# Altium schematic sheet power.SchDoc
size A4; SheetNumber: 1; SheetTotal: 3
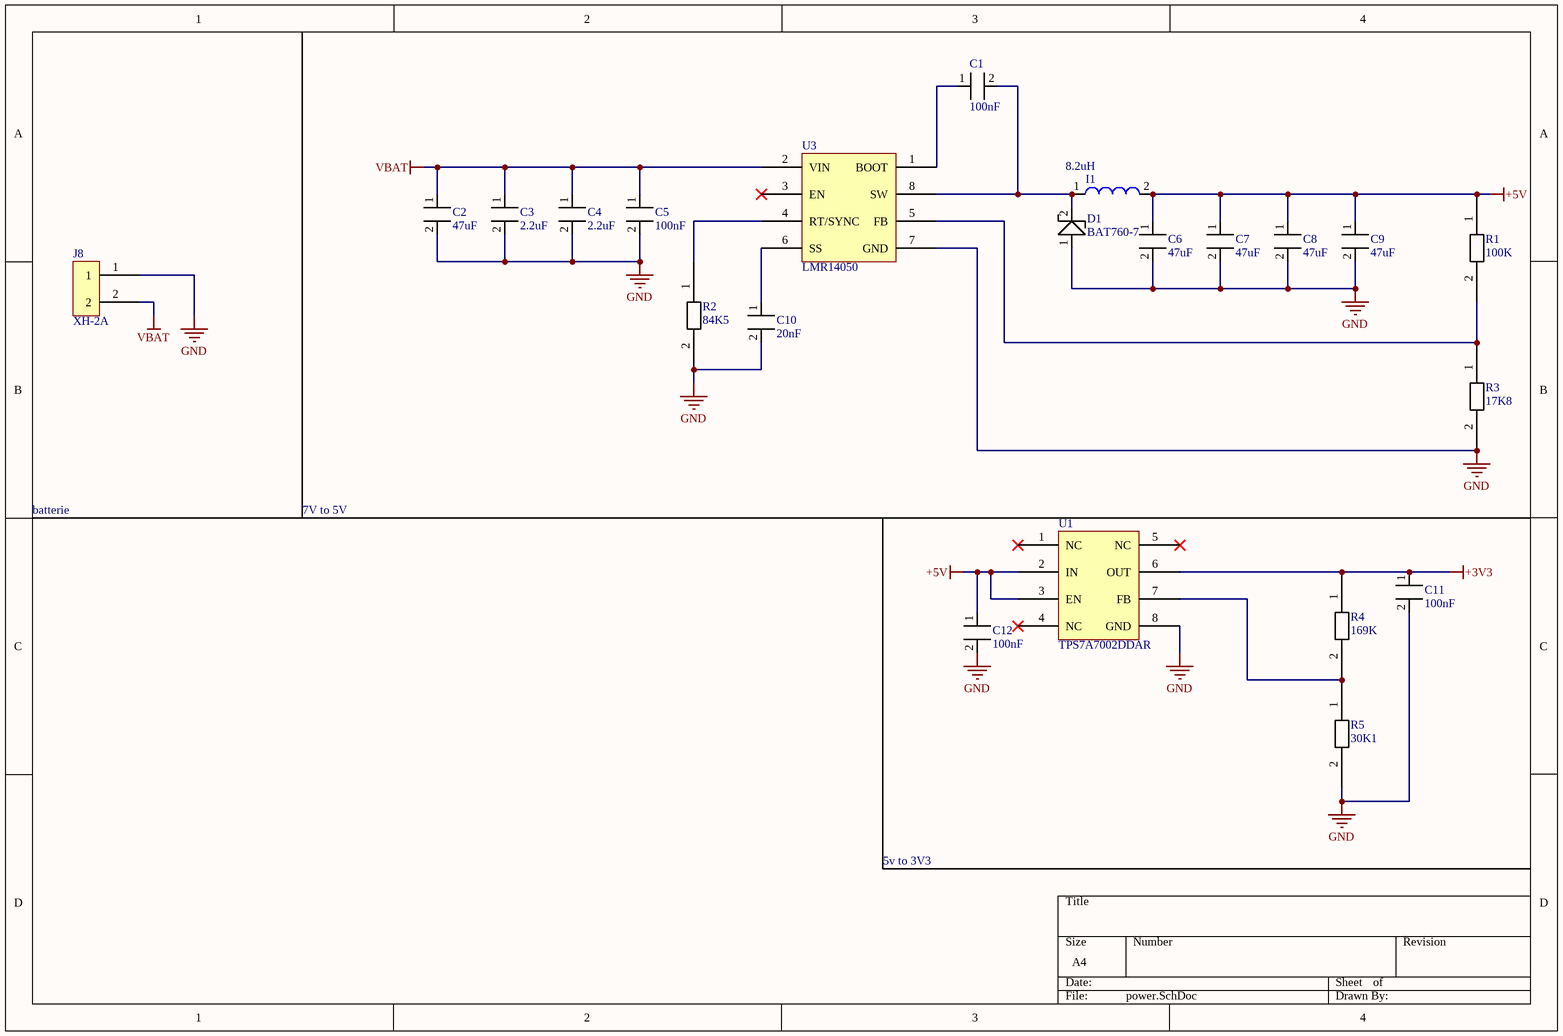
[diagram p0: power.SchDoc]

## Parts
C1  100nF  [Condo]
C2  47uF  [Condo]
C3  2.2uF  [Condo]
C4  2.2uF  [Condo]
C5  100nF  [Condo]
C6  47uF  [Condo]
C7  47uF  [Condo]
C8  47uF  [Condo]
C9  47uF  [Condo]
C10  20nF  [Condo]
C11  100nF  [Condo]
C12  100nF  [Condo]
D1  BAT760-7  [BAT760-7]
I1  8.2uH  [ILSB0805ER8R2K]
J8  XH-2A  [XH-2A]
R1  100K  [Resistor]
R2  84K5  [Resistor]
R3  17K8  [Resistor]
R4  169K  [Resistor]
R5  30K1  [Resistor]
U1  TPS7A7002DDAR  [TPS7A7002DDAR]
U3  LMR14050  [LMR14050]

## Nets
+3V3: C11.1(IN) R4.1 U1.6(OUT)
+5V: C6.1(IN) C7.1(IN) C8.1(IN) C9.1(IN) C12.1(IN) I1.2 R1.1 U1.2(IN) U1.3(EN)
GND: C2.2(OUT) C3.2(OUT) C4.2(OUT) C5.2(OUT) C6.2(OUT) C7.2(OUT) C8.2(OUT) C9.2(OUT) C10.2(OUT) C11.2(OUT) C12.2(OUT) D1.1 J8.1 R2.2 R3.2 R5.2 U1.8(GND) U3.7(GND)
VBAT: C2.1(IN) C3.1(IN) C4.1(IN) C5.1(IN) J8.2 U3.2(VIN)
NetC1_1: C1.1(IN) U3.1(BOOT)
NetC1_2: C1.2(OUT) D1.2 I1.1 U3.8(SW)
NetC10_1: C10.1(IN) U3.6(SS)
NetR1_2: R1.2 R3.1 U3.5(FB)
NetR2_1: R2.1 U3.4(RT/SYNC)
NetR4_2: R4.2 R5.1 U1.7(FB)

Not connected (* = marked no-connect by the designer): U1 1(NC)* 4(NC)* 5(NC)*; U3 3(EN)*

## Notes on the sheet
- batterie
- 7V to 5V
- 5v to 3V3

## Library data of the parts
C1-C12 = CAPA
I1 = ILSB0805ER8R2K
R1-R5 = Resistor